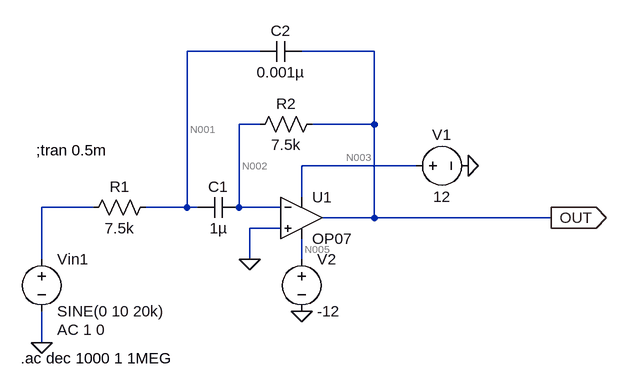
[diagram p0: schematic filter.asc]
filter.asc, the LTspice schematic file:
Version 4
SHEET 1 1088 680
WIRE 208 -96 96 -96
WIRE 384 -96 272 -96
WIRE 208 16 176 16
WIRE 384 16 384 -96
WIRE 384 16 288 16
WIRE 448 80 272 80
WIRE 272 128 272 80
WIRE -48 144 -128 144
WIRE 96 144 96 -96
WIRE 96 144 32 144
WIRE 112 144 96 144
WIRE 176 144 176 16
WIRE 240 144 176 144
WIRE 384 160 384 16
WIRE 384 160 304 160
WIRE 656 160 384 160
WIRE 240 176 192 176
WIRE -128 224 -128 144
WIRE 192 224 192 176
WIRE 272 224 272 192
WIRE -128 352 -128 304
FLAG 656 160 OUT
IOPIN 656 160 Out
FLAG -128 352 0
FLAG 528 80 0
FLAG 192 224 0
FLAG 272 304 0
SYMBOL voltage -128 208 R0
WINDOW 123 24 124 Left 2
WINDOW 39 0 0 Left 0
SYMATTR Value2 AC 1 0
SYMATTR InstName Vin1
SYMATTR Value SINE(0 10 20k)
SYMBOL OpAmps\\OP07 272 96 R0
SYMATTR InstName U1
SYMBOL res 48 128 R90
WINDOW 0 0 56 VBottom 2
WINDOW 3 32 56 VTop 2
SYMATTR InstName R1
SYMATTR Value 7.5k
SYMBOL cap 176 128 R90
WINDOW 0 0 32 VBottom 2
WINDOW 3 32 32 VTop 2
SYMATTR InstName C1
SYMATTR Value 1µ
SYMBOL res 304 0 R90
WINDOW 0 0 56 VBottom 2
WINDOW 3 32 56 VTop 2
SYMATTR InstName R2
SYMATTR Value 7.5k
SYMBOL cap 272 -112 R90
WINDOW 0 0 32 VBottom 2
WINDOW 3 32 32 VTop 2
SYMATTR InstName C2
SYMATTR Value 0.001µ
SYMBOL voltage 432 80 R270
WINDOW 0 32 56 VTop 2
WINDOW 3 -32 56 VBottom 2
WINDOW 123 0 0 Left 0
WINDOW 39 0 0 Left 0
SYMATTR InstName V1
SYMATTR Value 12
SYMBOL voltage 272 208 R0
WINDOW 123 0 0 Left 0
WINDOW 39 0 0 Left 0
SYMATTR InstName V2
SYMATTR Value -12
TEXT -160 376 Left 2 !.ac dec 1000 1 1MEG
TEXT -136 56 Left 2 !;tran 0.5m

The netlist it stands for:
* filter.asc
Vin1 N004 0 SINE(0 10 20k) AC 1 0
XU1 0 N002 N003 N005 OUT LT1001  ; OP07, pins In+ In- V+ V- OUT
R1 N001 N004 7.5k
C1 N002 N001 1µ
R2 OUT N002 7.5k
C2 OUT N001 0.001µ
V1 N003 0 12
V2 N005 0 -12
.ac dec 1000 1 1MEG
;tran 0.5m
.lib LTC.lib
.backanno
.end

* Results of the author's LTspice run, read from the files saved beside the schematic
* Operating Point, zero values left out:
*   V(n003) = 12 V
*   V(n005) = -12 V
*   I(V2) = 2.25 mA
*   I(V1) = -2.25 mA
*   Ix(u1:3) = 2.25 mA
*   Ix(u1:4) = -2.25 mA
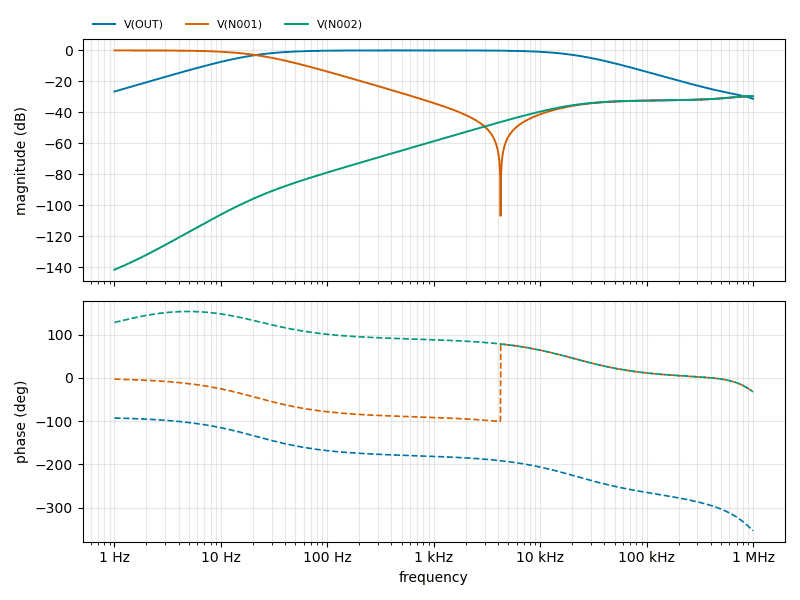
[diagram p1: AC Analysis of filter.asc, plotted from the saved traces]
* AC Analysis, 1 run:
*   V(OUT): -26.54 dB at 1 Hz, -31.28 dB at 1 MHz, peak -0.01 dB at 662.2 Hz, 3 dB below the peak at 21.18 Hz and 20.76 kHz
*   V(N001): -0.01 dB at 1 Hz, -29.64 dB at 1 MHz, peak -0.01 dB at 1 Hz, 3 dB below the peak at 21.27 Hz
*   V(N002): -141.49 dB at 1 Hz, -29.64 dB at 1 MHz, peak -29.54 dB at 916.2 kHz, 3 dB below the peak at 74.25 kHz